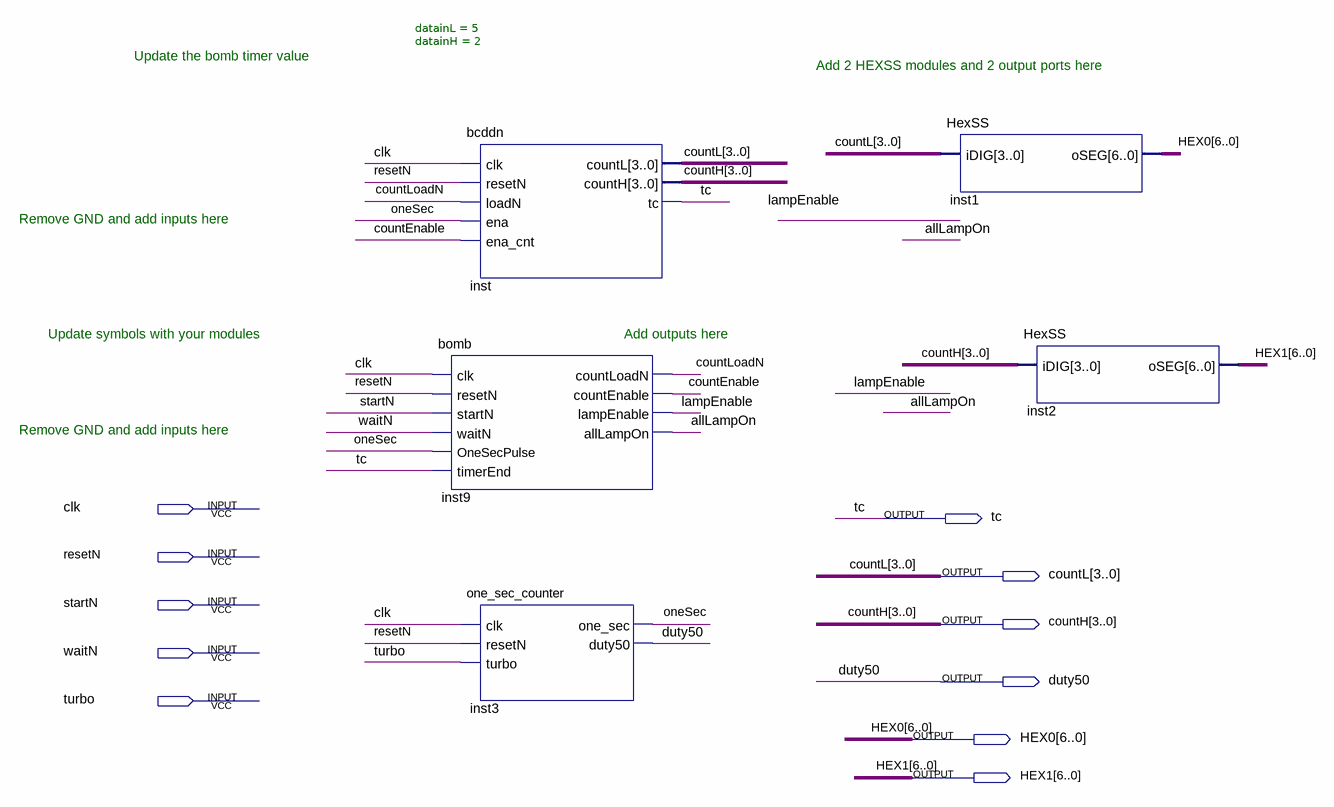
[diagram p0: schematic sheet]
// Quartus schematic topBomb.bdf as structural Verilog: 5 symbols, 11 pins
module topBomb (
  input  clk,
  input  resetN,
  input  startN,
  input  waitN,
  input  turbo,
  output tc,
  output [3:0] countL,
  output [3:0] countH,
  output duty50,
  output [6:0] HEX0,
  output [6:0] HEX1
);

  wire allLampOn, countEnable, countLoadN, lampEnable, oneSec;

  bcddn #(.datainL(5), .datainH(2)) inst (
    .clk(clk), .resetN(resetN), .loadN(countLoadN), .ena(oneSec), .ena_cnt(countEnable), .countL(countL),
    .countH(countH), .tc(tc));
  bomb inst9 (
    .clk(clk), .resetN(resetN), .startN(startN), .waitN(waitN), .OneSecPulse(oneSec), .timerEnd(tc),
    .countLoadN(countLoadN), .countEnable(countEnable), .lampEnable(lampEnable), .allLampOn(allLampOn));
  one_sec_counter inst3 (.clk(clk), .resetN(resetN), .turbo(turbo), .one_sec(oneSec), .duty50(duty50));
  HexSS inst1 (.iDIG(countL), .oSEG(HEX0));
  HexSS inst2 (.iDIG(countH), .oSEG(HEX1));

  // Notes on the sheet:
  //   Update the bomb timer value
  //   Add 2 HEXSS modules and 2 output ports here
  //   Remove GND and add inputs here
  //   Update symbols with your modules
  //   Add outputs here
  //   Remove GND and add inputs here
endmodule
